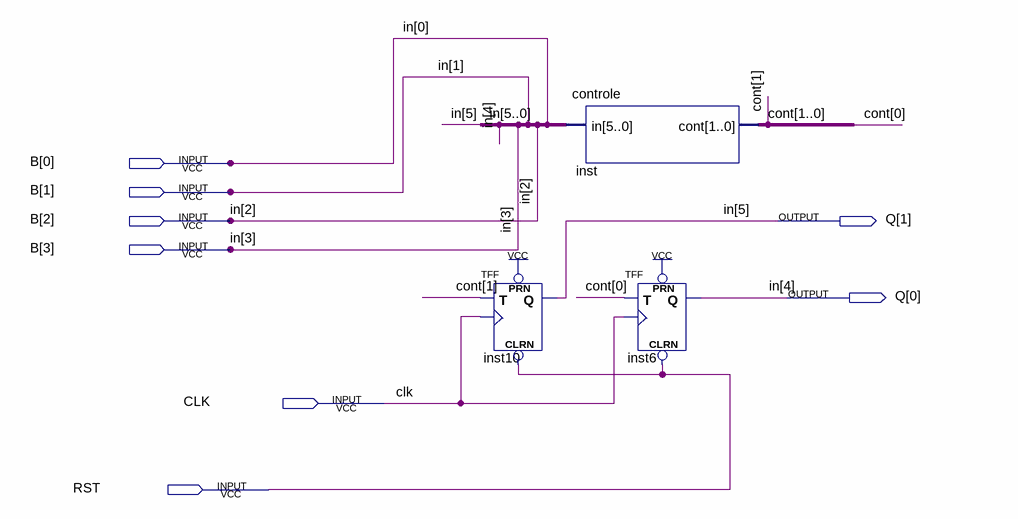
[diagram p0: schematic sheet]
// Quartus schematic MaquinaDeEstados.bdf as structural Verilog: 3 symbols, 8 pins
module MaquinaDeEstados (
  input  [3:0] B,
  input  CLK,
  input  RST,
  output [1:0] Q
);

  wire [1:0] cont;

  TFF inst10 (.PRN(1'b1), .CLRN(RST), .T(cont[1]), .CLK(CLK), .Q(Q[1]));
  controle inst (.in({Q, B}), .cont(cont));
  TFF inst6 (.PRN(1'b1), .CLRN(RST), .T(cont[0]), .CLK(CLK), .Q(Q[0]));

  // Other names for the same wires on the sheet: in[5:0] = {Q, B}
endmodule
